# Altium schematic sheet KK_Triangle_cubic.SchDoc
size A2; Organization: Altium Limited; Address1: L3, 12a Rodborough Rd; Address2: Frenchs Forest; Address3: NSW; Address4: Australia 2086
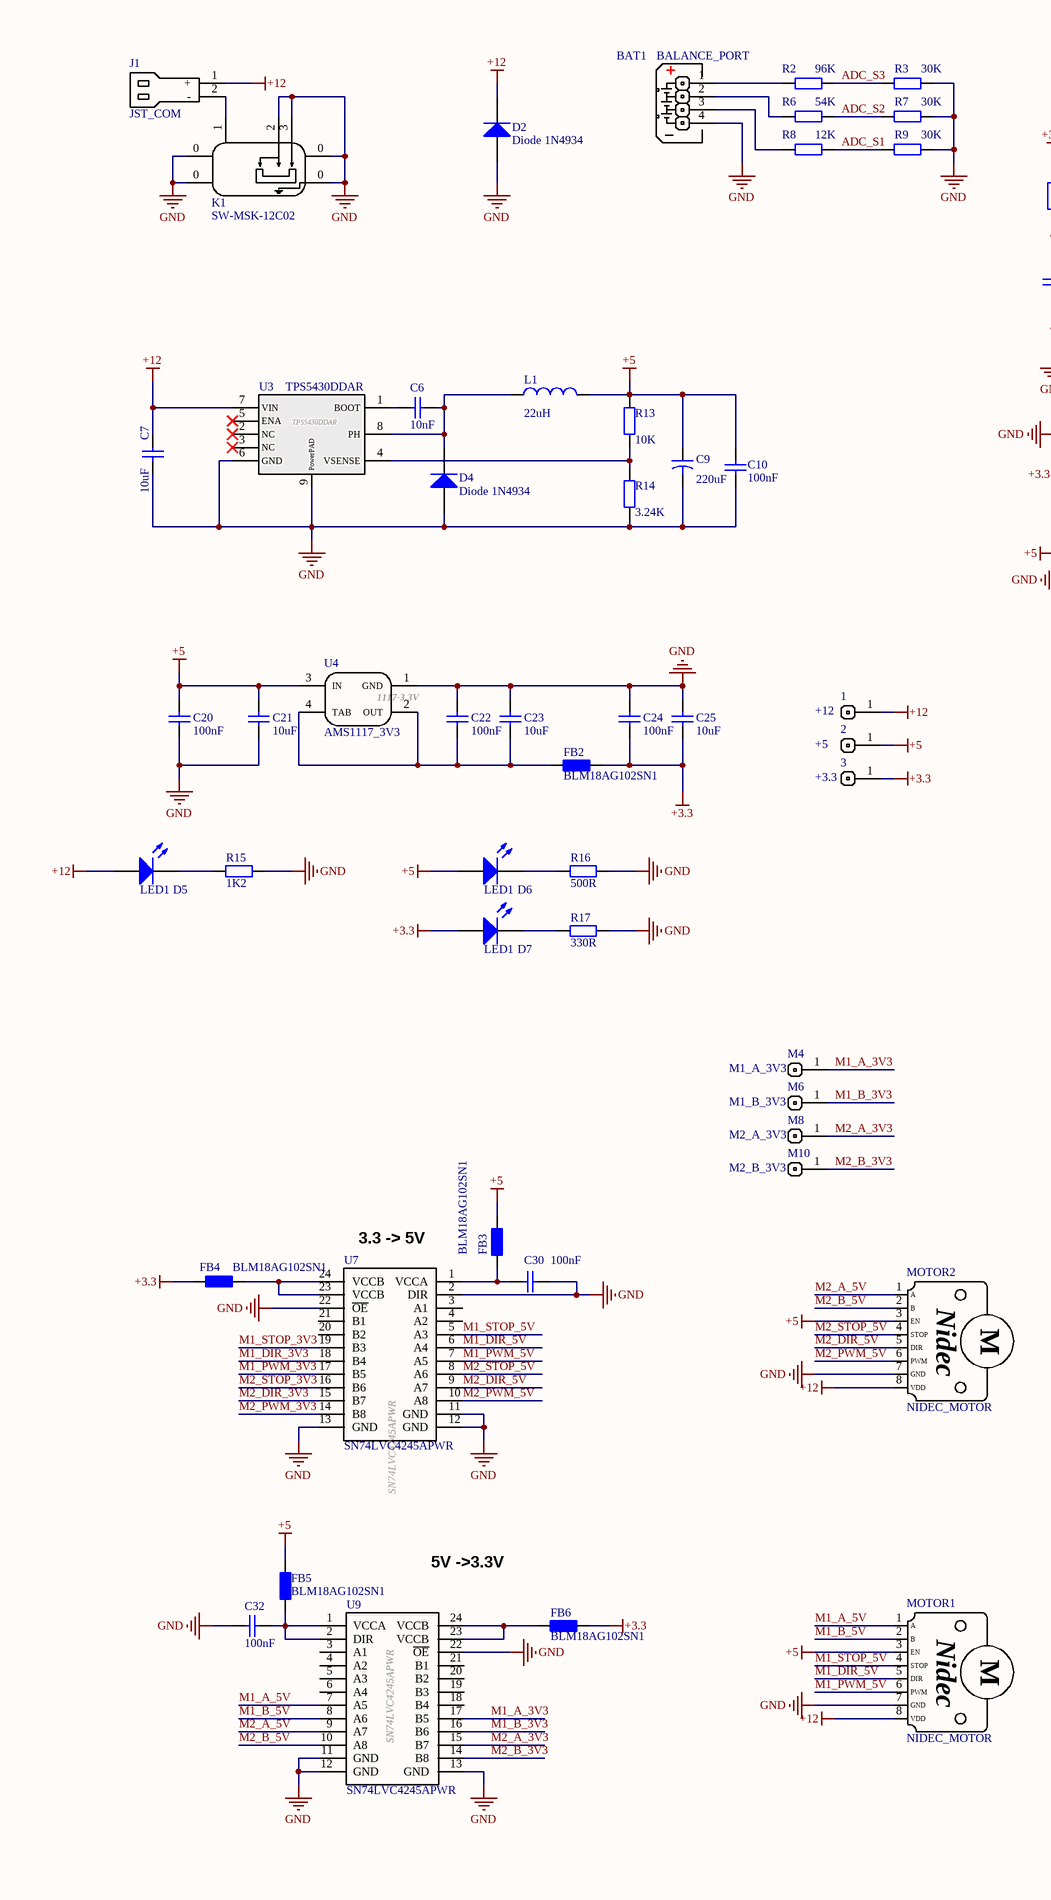
[diagram p0: KK_Triangle_cubic.SchDoc, left]
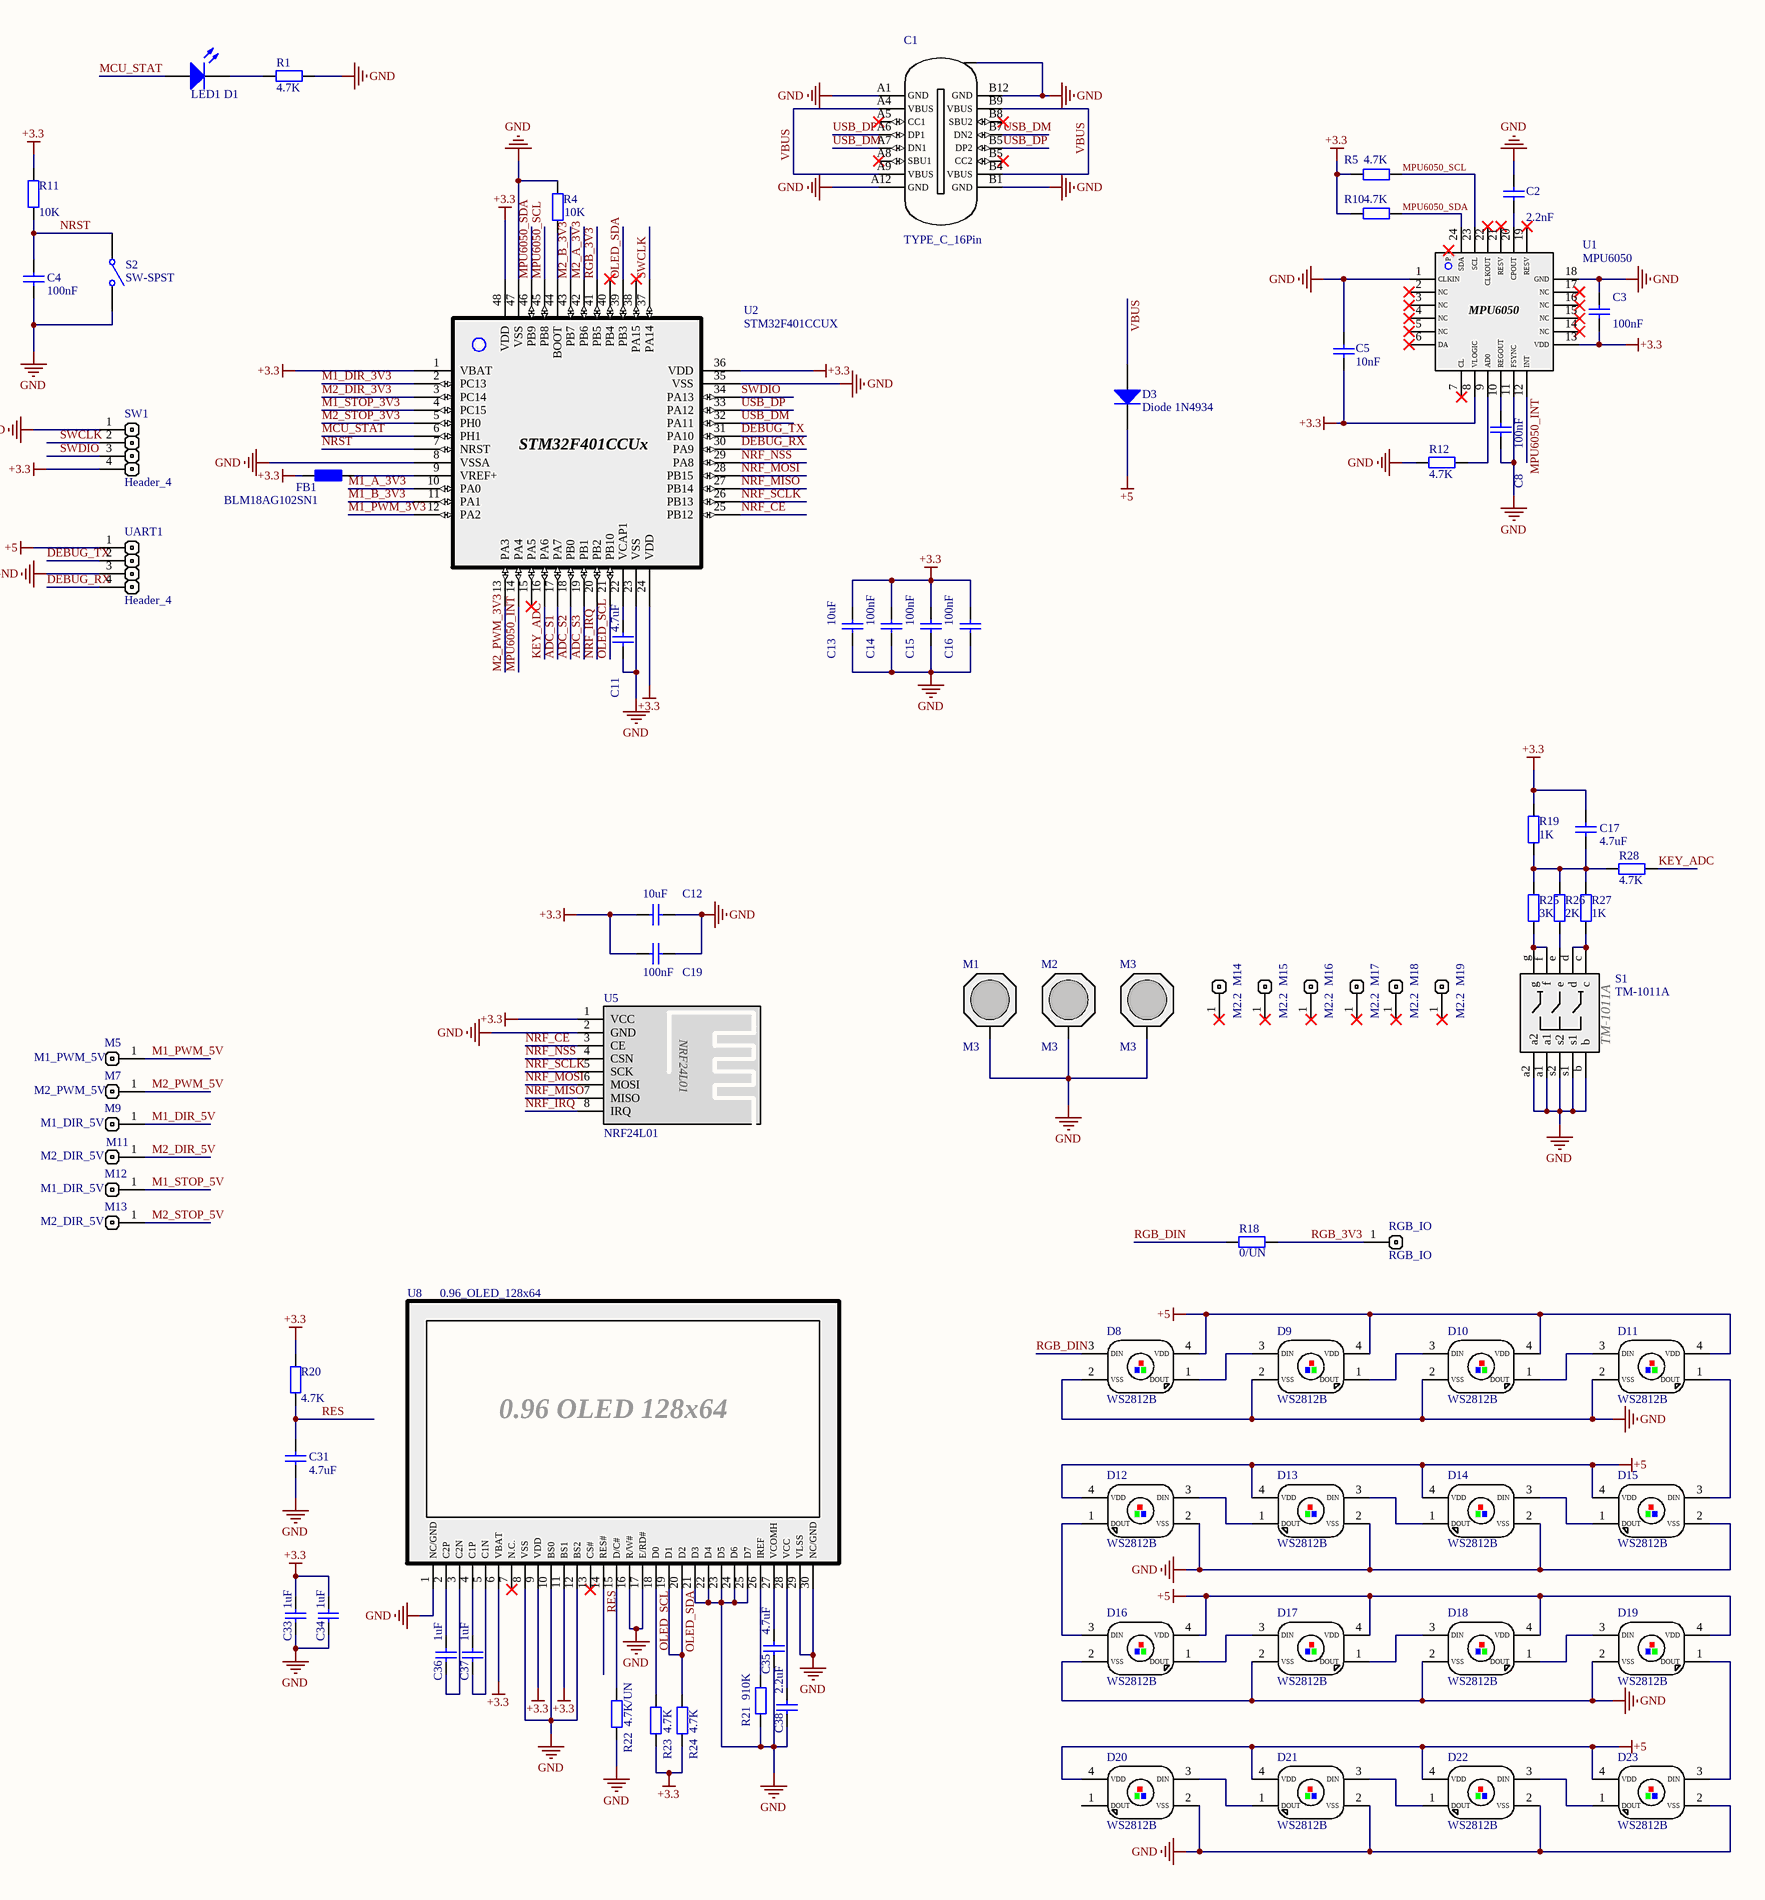
[diagram p1: KK_Triangle_cubic.SchDoc, right]

## Parts
1  +12  [TEST_POINT]
2  +5  [TEST_POINT]
3  +3.3  [TEST_POINT]
BAT1  BALANCE_PORT  [XH2.54-LI-4P]
C1  TYPE_C_16Pin  [USB-C-SMD_TYPE-C-USB-5]
C2  value 2.2nF  [C 0603_M]  (hidden comment: Cap)
C3  value 100nF  [C 0603_M]  (hidden comment: Cap)
C4  value 100nF  [C 0603_M]  (hidden comment: Cap)
C5  value 10nF  [C 0603_M]  (hidden comment: Cap)
C6  value 10nF  [C 0603_M]  (hidden comment: Cap)
C7  value 10uF  [C 0603_M]  (hidden comment: Cap)
C8  value 100nF  [C 0603_M]  (hidden comment: Cap)
C9  value 220uF  [CM D(6.3*7.7)]  (hidden comment: Cap2)
C10  value 100nF  [C 0603_M]  (hidden comment: Cap)
C11  value 4.7uF  [C 0603_M]  (hidden comment: Cap)
C12  value 10uF  [C 0603_M]  (hidden comment: Cap)
C13  value 10uF  [C 0603_M]  (hidden comment: Cap)
C14  value 100nF  [C 0603_M]  (hidden comment: Cap)
C15  value 100nF  [C 0603_M]  (hidden comment: Cap)
C16  value 100nF  [C 0603_M]  (hidden comment: Cap)
C17  value 4.7uF  [C 0603_M]  (hidden comment: Cap)
C19  value 100nF  [C 0603_M]  (hidden comment: Cap)
C20  value 100nF  [C 0603_M]  (hidden comment: Cap)
C21  value 10uF  [C 0603_M]  (hidden comment: Cap)
C22  value 100nF  [C 0603_M]  (hidden comment: Cap)
C23  value 10uF  [C 0603_M]  (hidden comment: Cap)
C24  value 100nF  [C 0603_M]  (hidden comment: Cap)
C25  value 10uF  [C 0603_M]  (hidden comment: Cap)
C30  value 100nF  [C 0603_M]  (hidden comment: Cap)
C31  value 4.7uF  [C 0603_M]  (hidden comment: Cap)
C32  value 100nF  [C 0603_M]  (hidden comment: Cap)
C33  value 1uF  [C 0603_M]  (hidden comment: Cap)
C34  value 1uF  [C 0603_M]  (hidden comment: Cap)
C35  value 4.7uF  [C 0603_M]  (hidden comment: Cap)
C36  value 1uF  [C 0603_M]  (hidden comment: Cap)
C37  value 1uF  [C 0603_M]  (hidden comment: Cap)
C38  value 2.2uF  [C 0603_M]  (hidden comment: Cap)
D1  LED1  [LED 0805G]
D2  Diode 1N4934  [1N5819(SMD)]
D3  Diode 1N4934  [SOD-323]
D4  Diode 1N4934  [1N5819(SMD)]
D5  LED1  [LED 0805G]
D6  LED1  [LED 0805G]
D7  LED1  [LED 0805G]
D8  WS2812B  [WS2812B-2020]
D9  WS2812B  [WS2812B-2020]
D10  WS2812B  [WS2812B-2020]
D11  WS2812B  [WS2812B-2020]
D12  WS2812B  [WS2812B-2020]
D13  WS2812B  [WS2812B-2020]
D14  WS2812B  [WS2812B-2020]
D15  WS2812B  [WS2812B-2020]
D16  WS2812B  [WS2812B-2020]
D17  WS2812B  [WS2812B-2020]
D18  WS2812B  [WS2812B-2020]
D19  WS2812B  [WS2812B-2020]
D20  WS2812B  [WS2812B-2020]
D21  WS2812B  [WS2812B-2020]
D22  WS2812B  [WS2812B-2020]
D23  WS2812B  [WS2812B-2020]
FB1  BLM18AG102SN1  [L 0603]
FB2  BLM18AG102SN1  [L 0603]
FB3  BLM18AG102SN1  [L 0603]
FB4  BLM18AG102SN1  [L 0603]
FB5  BLM18AG102SN1  [L 0603]
FB6  BLM18AG102SN1  [L 0603]
J1  JST_COM  [JST_COM]
K1  SW-MSK-12C02  [MSK-12C01-07]
L1  value 22uH  [CDRH74]  (hidden comment: Inductor)
M1  M3  [M3x40+6_L]
M2  M3  [M3x40+6_L]
M3  M3  [M3x40+6_L]
M4  M1_A_3V3  [TEST_POINT]
M5  M1_PWM_5V  [TEST_POINT]
M6  M1_B_3V3  [TEST_POINT]
M7  M2_PWM_5V  [TEST_POINT]
M8  M2_A_3V3  [TEST_POINT]
M9  M1_DIR_5V  [TEST_POINT]
M10  M2_B_3V3  [TEST_POINT]
M11  M2_DIR_5V  [TEST_POINT]
M12  M1_DIR_5V  [TEST_POINT]
M13  M2_DIR_5V  [TEST_POINT]
M14  M2.2  [H2.2]
M15  M2.2  [H2.2]
M16  M2.2  [H2.2]
M17  M2.2  [H2.2]
M18  M2.2  [H2.2]
M19  M2.2  [H2.2]
MOTOR1  NIDEC_MOTOR  [MX 1.25-LS-8P]
MOTOR2  NIDEC_MOTOR  [MX 1.25-LS-8P]
R1  value 4.7K  [R 0603_M]  (hidden comment: Res2)
R2  value 96K  [R 0603_M]  (hidden comment: Res2)
R3  value 30K  [R 0603_M]  (hidden comment: Res2)
R4  value 10K  [R 0603_M]  (hidden comment: Res2)
R5  value 4.7K  [R 0603_M]  (hidden comment: Res2)
R6  value 54K  [R 0603_M]  (hidden comment: Res2)
R7  value 30K  [R 0603_M]  (hidden comment: Res2)
R8  value 12K  [R 0603_M]  (hidden comment: Res2)
R9  value 30K  [R 0603_M]  (hidden comment: Res2)
R10  value 4.7K  [R 0603_M]  (hidden comment: Res2)
R11  value 10K  [R 0603_M]  (hidden comment: Res2)
R12  value 4.7K  [R 0603_M]  (hidden comment: Res2)
R13  value 10K  [R 0603_M]  (hidden comment: Res2)
R14  value 3.24K  [R 0603_M]  (hidden comment: Res2)
R15  value 1K2  [R 0603_M]  (hidden comment: Res2)
R16  value 500R  [R 0603_M]  (hidden comment: Res2)
R17  value 330R  [R 0603_M]  (hidden comment: Res2)
R18  value 0/UN  [R 0603_M]  (hidden comment: Res2)
R19  value 1K  [R 0603_M]  (hidden comment: Res2)
R20  value 4.7K  [R 0603_M]  (hidden comment: Res2)
R21  value 910K  [R 0603_M]  (hidden comment: Res2)
R22  value 4.7K/UN  [R 0603_M]  (hidden comment: Res2)
R23  value 4.7K  [R 0603_M]  (hidden comment: Res2)
R24  value 4.7K  [R 0603_M]  (hidden comment: Res2)
R25  value 3K  [R 0603_M]  (hidden comment: Res2)
R26  value 2K  [R 0603_M]  (hidden comment: Res2)
R27  value 1K  [R 0603_M]  (hidden comment: Res2)
R28  value 4.7K  [R 0603_M]  (hidden comment: Res2)
RGB_IO  RGB_IO  [TEST_POINT]
S1  TM-1011A  [TM-1011A]
S2  SW-SPST  [TSW SMD-3*6*2.5]
SW1  Header_4  [PH2.0-L-Z-4P]
U1  MPU6050  [QFN24 4x4_M]
U2  STM32F401CCUX  [STM-UFQFPN48_M]
U3  TPS5430DDAR  [TPS5430DDAR]
U4  AMS1117_3V3  [SOT223_M]
U5  NRF24L01  [NRF24L01_MIN]
U7  SN74LVC4245APWR  [TSSOP24_M]
U8  0.96_OLED_128x64  [0.96_OLED]
U9  SN74LVC4245APWR  [TSSOP24_M]
UART1  Header_4  [PH2.0-L-Z-4P]

## Nets
+3.3: 3.1 C3.1 C5.1 C12.2 C13.2 C14.2 C15.2 C16.2 C17.1 C19.2 C24.1 C25.1 C33.2 C34.2 D7.1(A) FB1.1 FB2.2 FB4.2 FB6.2 R5.2 R10.2 R11.2 R19.2 R20.2 R23.1 R24.1 SW1.4 U1.8(VLOGIC) U1.13(VDD) U2.1(VBAT) U2.24(VDD) U2.36(VDD) U2.48(VDD) U5.1(VCC) U8.6(VBAT) U8.9(VDD) U8.11(BS1)
+5: 2.1 C9.1 C10.1 C20.2 C21.2 D3.K D6.1(A) D8.4(VDD) D9.4(VDD) D10.4(VDD) D11.4(VDD) D12.4(VDD) D13.4(VDD) D14.4(VDD) D15.4(VDD) D16.4(VDD) D17.4(VDD) D18.4(VDD) D19.4(VDD) D20.4(VDD) D21.4(VDD) D22.4(VDD) D23.4(VDD) FB3.2 FB5.2 L1.2 MOTOR1.3(EN) MOTOR2.3(EN) R13.2 U4.3(IN) UART1.1
+12: 1.1 C7.2 D2.K D5.1(A) J1.1(+) MOTOR1.8(VDD) MOTOR2.8(VDD) U3.7(VIN)
GND: BAT1.4 C1.0 C1.A1(GND) C1.A12(GND) C1.B1(GND) C1.B12(GND) C2.2 C3.2 C4.1 C5.2 C7.1 C8.1 C9.2 C10.2 C11.2 C12.1 C13.1 C14.1 C15.1 C16.1 C19.1 C20.1 C21.1 C22.2 C23.2 C24.2 C25.2 C30.1 C31.1 C32.1 C33.1 C34.1 C35.2 C38.2 D2.A D4.A D8.2(VSS) D9.2(VSS) D10.2(VSS) D11.2(VSS) D12.2(VSS) D13.2(VSS) D14.2(VSS) D15.2(VSS) D16.2(VSS) D17.2(VSS) D18.2(VSS) D19.2(VSS) D20.2(VSS) D21.2(VSS) D22.2(VSS) D23.2(VSS) K1.0 K1.2 K1.3 M1.1 M2.1 M3.1 MOTOR1.7(GND) MOTOR2.7(GND) R1.1 R3.1 R4.2 R7.1 R9.1 R12.1 R14.1 R15.1 R16.1 R17.1 R21.2 R22.1 S1.a1 S1.a2 S1.b S1.s1 S1.s2 S2.2(NO) SW1.1 U1.1(CLKIN) U1.11(FSYNC) U1.18(GND) U2.8(VSSA) U2.23(VSS) U2.35(VSS) U2.47(VSS) U3.6(GND) U3.9(PowerPAD) U4.1(GND) U5.2(GND) U7.2(DIR) U7.11(GND) U7.12(GND) U7.13(GND) U7.22(~{OE}) U8.1(NC/GND) U8.8(VSS) U8.10(BS0) U8.12(BS2) U8.16(R/W#) U8.17(E/RD#) U8.21(D3) U8.22(D4) U8.23(D5) U8.24(D6) U8.25(D7) U8.29(VLSS) U8.30(NC/GND) U9.11(GND) U9.12(GND) U9.13(GND) U9.22(~{OE}) UART1.3
ADC_S1: R8.1 R9.2 U2.17(PA7)
ADC_S2: R6.1 R7.2 U2.18(PB0)
ADC_S3: R2.1 R3.2 U2.19(PB1)
DEBUG_RX: U2.30(PA9) UART1.4
DEBUG_TX: U2.31(PA10) UART1.2
KEY_ADC: R28.1 U2.16(PA6)
M1_A_3V3: M4.1 U2.10(PA0) U9.17(B5)
M1_A_5V: MOTOR1.1(A) U9.7(A5)
M1_B_3V3: M6.1 U2.11(PA1) U9.16(B6)
M1_B_5V: MOTOR1.2(B) U9.8(A6)
M1_DIR_3V3: U2.2(PC13) U7.18(B4)
M1_DIR_5V: M9.1 MOTOR1.5(DIR) U7.6(A4)
M1_PWM_3V3: U2.12(PA2) U7.17(B5)
M1_PWM_5V: M5.1 MOTOR1.6(PWM) U7.7(A5)
M1_STOP_3V3: U2.4(PC15) U7.19(B3)
M1_STOP_5V: M12.1 MOTOR1.4(STOP) U7.5(A3)
M2_A_3V3: M8.1 U2.42(PB6) U9.15(B7)
M2_A_5V: MOTOR2.1(A) U9.9(A7)
M2_B_3V3: M10.1 U2.43(PB7) U9.14(B8)
M2_B_5V: MOTOR2.2(B) U9.10(A8)
M2_DIR_3V3: U2.3(PC14) U7.15(B7)
M2_DIR_5V: M11.1 MOTOR2.5(DIR) U7.9(A7)
M2_PWM_3V3: U2.13(PA3) U7.14(B8)
M2_PWM_5V: M7.1 MOTOR2.6(PWM) U7.10(A8)
M2_STOP_3V3: U2.5(PH0) U7.16(B6)
M2_STOP_5V: M13.1 MOTOR2.4(STOP) U7.8(A6)
MCU_STAT: D1.1(A) U2.6(PH1)
MPU6050_INT: U1.12(INT) U2.14(PA4)
MPU6050_SCL: R5.1 U1.23(SCL) U2.45(PB8)
MPU6050_SDA: R10.1 U1.24(SDA) U2.46(PB9)
NRF_CE: U2.25(PB12) U5.3(CE)
NRF_IRQ: U2.20(PB2) U5.8(IRQ)
NRF_MISO: U2.27(PB14) U5.7(MISO)
NRF_MOSI: U2.28(PB15) U5.6(MOSI)
NRF_NSS: U2.29(PA8) U5.4(CSN)
NRF_SCLK: U2.26(PB13) U5.5(SCK)
NRST: C4.2 R11.1 S2.1(COMMON) U2.7(NRST)
OLED_SCL: R23.2 U2.21(PB10) U8.18(D0)
OLED_SDA: R24.2 U2.39(PB3) U8.19(D1) U8.20(D2)
RES: C31.2 R20.1 U8.14(RES#)
RGB_3V3: R18.2 RGB_IO.1 U2.41(PB5)
RGB_DIN: D8.3(DIN) R18.1
SWCLK: SW1.2 U2.37(PA14)
SWDIO: SW1.3 U2.34(PA13)
USB_DM: C1.A7(DN1) C1.B7(DN2) U2.32(PA11)
USB_DP: C1.A6(DP1) C1.B5(DP2) U2.33(PA12)
VBUS: C1.A4(VBUS) C1.A9(VBUS) C1.B4(VBUS) C1.B9(VBUS) D3.A
NetBAT1_1: BAT1.1 R2.2
NetBAT1_2: BAT1.2 R6.2
NetBAT1_3: BAT1.3 R8.2
NetC2_1: C2.1 U1.20(CPOUT)
NetC6_1: C6.1 D4.K L1.1 U3.8(PH)
NetC6_2: C6.2 U3.1(BOOT)
NetC8_2: C8.2 U1.10(REGOUT)
NetC11_1: C11.1 U2.22(VCAP1)
NetC17_2: C17.2 R19.1 R25.1 R26.1 R27.1 R28.2
NetC22_1: C22.1 C23.1 FB2.1 U4.2(OUT) U4.4(TAB)
NetC30_2: C30.2 FB3.1 U7.1(VCCA)
NetC32_2: C32.2 FB5.1 U9.1(VCCA) U9.2(DIR)
NetC35_1: C35.1 U8.27(VCOMH)
NetC36_1: C36.1 U8.2(C2P)
NetC36_2: C36.2 U8.3(C2N)
NetC37_1: C37.1 U8.4(C1P)
NetC37_2: C37.2 U8.5(C1N)
NetC38_1: C38.1 U8.28(VCC)
NetD1_2: D1.2(K) R1.2
NetD5_2: D5.2(K) R15.2
NetD6_2: D6.2(K) R16.2
NetD7_2: D7.2(K) R17.2
NetD8_1: D8.1(DOUT) D9.3(DIN)
NetD9_1: D9.1(DOUT) D10.3(DIN)
NetD10_1: D10.1(DOUT) D11.3(DIN)
NetD11_1: D11.1(DOUT) D15.3(DIN)
NetD12_1: D12.1(DOUT) D16.3(DIN)
NetD12_3: D12.3(DIN) D13.1(DOUT)
NetD13_3: D13.3(DIN) D14.1(DOUT)
NetD14_3: D14.3(DIN) D15.1(DOUT)
NetD16_1: D16.1(DOUT) D17.3(DIN)
NetD17_1: D17.1(DOUT) D18.3(DIN)
NetD18_1: D18.1(DOUT) D19.3(DIN)
NetD19_1: D19.1(DOUT) D23.3(DIN)
NetD20_3: D20.3(DIN) D21.1(DOUT)
NetD21_3: D21.3(DIN) D22.1(DOUT)
NetD22_3: D22.3(DIN) D23.1(DOUT)
NetFB1_2: FB1.2 U2.9(VREF+)
NetFB4_1: FB4.1 U7.23(VCCB) U7.24(VCCB)
NetFB6_1: FB6.1 U9.23(VCCB) U9.24(VCCB)
NetJ1_2: J1.2(-) K1.1
NetR4_1: R4.1 U2.44(BOOT)
NetR12_2: R12.2 U1.9(AD0)
NetR13_1: R13.1 R14.2 U3.4(VSENSE)
NetR21_1: R21.1 U8.26(IREF)
NetR22_2: R22.2 U8.15(D/C#)
NetR25_2: R25.2 S1.f S1.g
NetR26_2: R26.2 S1.e
NetR27_2: R27.2 S1.c S1.d

Not connected (* = marked no-connect by the designer): C1 A5(CC1)* A8(SBU1)* B8(SBU2)*; D20 1(DOUT); M14 1*; M15 1*; M16 1*; M17 1*; M18 1*; M19 1*; U1 2(NC)* 3(NC)* 4(NC)* 5(NC)* 6(DA)* 7(CL)* 14(NC)* 15(NC)* 16(NC)* 17(NC)* 19(RESV)* 21(RESV)* 22(CLKOUT)* 25(P)*; U2 15(PA5)* 38(PA15)* 40(PB4)*; U3 2(NC)* 3(NC)* 5(ENA)*; U7 3(A1) 4(A2) 20(B2) 21(B1); U8 7(N.C.)* 13(CS#)*; U9 3(A1) 4(A2) 5(A3) 6(A4) 18(B4) 19(B3) 20(B2) 21(B1)

## Notes on the sheet
- (near U7) 3.3 -> 5V
- 5V ->3.3V
- Title
- Size:
- Date:
- File:
- A2
- Number:
- Time:
- Revision:
- Sheet
- of
- (in symbol 0.96_OLED_128x64) 0.96 OLED 128x64
- (in symbol AMS1117_3V3) 1117-3.3V
- (in symbol NIDEC_MOTOR) Nidec; M
- (in symbol STM32F401CCUX) STM32F401CCUx

## Library data of the parts
1-3 M4-M13 RGB_IO = TEST_POINT
C2-C8 C10-C17 C19-C25 C30-C38 = Cap: Capacitor; Published: 8-Jun-2000; LatestRevisionDate: 17-Jul-2002; LatestRevisionNote: Re-released for DXP Platform.; PackageReference: RAD-0.3; Publisher: Altium Limited; PackageDescription: Radial Cap, Thru-Hole; 2 Leads; 0.3 in Pin Spacing
C9 = Cap2: Capacitor; Published: 23-Sep-2002; PackageReference: CAPR5-4X5; Publisher: Altium Limited; PackageDescription: Capacitor; 2 Leads
D1 D5-D7 = LED1: Typical RED GaAs LED; Published: 8-Jun-2000; LatestRevisionDate: 08-Jul-2005; LatestRevisionNote: Mech Layer 1 removed.; PackageReference: LED-1; Publisher: Altium Limited; PackageDescription: LED; 2 Leads
D2-D4 = Diode 1N4934: 1 Amp Fast Recovery Rectifier; Published: 8-Jun-2000; LatestRevisionDate: 17-Jul-2002; LatestRevisionNote: Re-released for DXP Platform.; DatasheetVersion: 1999; PackageVersion: Aug-1999; PackageReference: DO-41; Publisher: Altium Limited; PackageDescription: Diode, Axial; Body 5.2 x 2.7 mm (LxDia. max), Lead Dia. 0.86 mm (max); Code_JEDEC: DO-204-AL; ComponentLink1Description: Manufacturer Link; ComponentLink1URL: http://www.fairchildsemi.com/; ComponentLink2Description: Datasheet; ComponentLink2URL: http://www.fairchildsemi.com/ds/1N%2F1N4934.pdf
D8-D23 = WS2812B_2020
L1 = Inductor: Code_IEC: 1005; Published: 8-Jun-2000; LatestRevisionDate: 29-May-2009; LatestRevisionNote: IPC-7351 Footprint Added.; PackageReference: 0402-A; Publisher: Altium Limited; PackageDescription: Chip Inductor; Code_JEITA: 0402
R1-R28 = Res2: Resistor; Published: 8-Jun-2000; LatestRevisionDate: 17-Jul-2002; LatestRevisionNote: Re-released for DXP Platform.; PackageReference: AXIAL-0.4; Publisher: Altium Limited; PackageDescription: Axial Device, Thru-Hole; 2 Leads; 0.4 in Pin Spacing
S2 = SW-SPST: Single-Pole, Single-Throw Switch; Published: 24-Mar-1999; LatestRevisionDate: 17-Jul-2002; LatestRevisionNote: Re-released for DXP Platform.; PackageReference: SPST-2; Publisher: Altium Limited; PackageDescription: Switch; 2 Leads